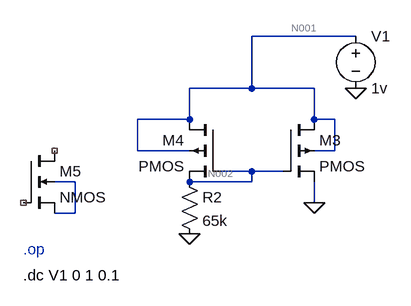
[diagram p0: schematic Draft3.asc]
Draft3.asc, the LTspice schematic file:
Version 4
SHEET 1 880 688
WIRE 368 304 208 304
WIRE 208 384 208 304
WIRE 208 384 112 384
WIRE 304 384 208 384
WIRE 112 432 112 384
WIRE 112 432 32 432
WIRE 304 432 304 384
WIRE 336 432 304 432
WIRE 32 480 32 432
WIRE 112 480 32 480
WIRE 336 480 336 432
WIRE 336 480 304 480
WIRE 208 512 160 512
WIRE 256 512 208 512
WIRE -64 528 -96 528
WIRE 208 528 208 512
WIRE 208 528 112 528
WIRE 304 560 304 528
WIRE -64 576 -64 528
WIRE -64 576 -96 576
FLAG 112 608 0
FLAG 304 560 0
FLAG 368 384 0
SYMBOL pmos4 256 432 R0
SYMATTR InstName M3
SYMBOL pmos4 160 432 M0
SYMATTR InstName M4
SYMBOL res 96 512 R0
SYMATTR InstName R2
SYMATTR Value 65k
SYMBOL voltage 368 288 R0
WINDOW 123 0 0 Left 0
WINDOW 39 0 0 Left 0
SYMATTR InstName V1
SYMATTR Value 1v
SYMBOL nmos4 -144 480 R0
SYMATTR InstName M5
TEXT -144 632 Left 2 ;.op
TEXT -144 672 Left 2 !.dc V1 0 1 0.1

The netlist it stands for:
* Draft3.asc
M3 N001 N002 0 N001 PMOS
M4 N001 N002 N002 N001 PMOS
R2 N002 0 65k
V1 N001 0 1v
M5 NC_01 NC_02 N003 N003 NMOS
.model NMOS NMOS
.model PMOS PMOS
.lib standard.mos
* .op
.dc V1 0 1 0.1
.backanno
.end

* Results of the author's LTspice run, read from the files saved beside the schematic
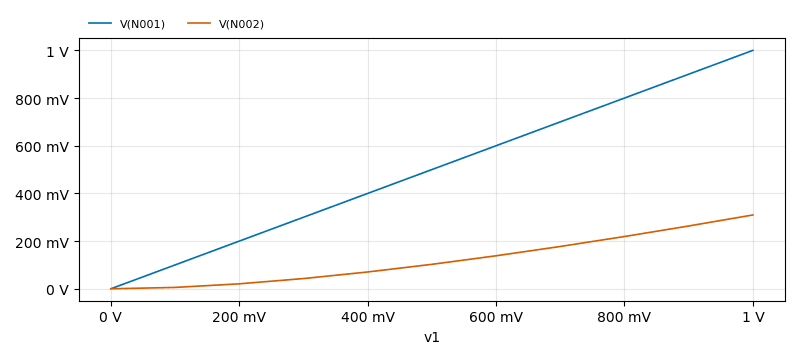
[diagram p1: DC transfer characteristic of Draft3.asc, plotted from the saved traces]
* DC transfer characteristic, 1 run:
*   V(N001): 0 V at v1=0 V, 1 V at v1=1 V, min 0 V, max 1 V
*   V(N002): 0 V at v1=0 V, 309.7 mV at v1=1 V, min 0 V, max 309.7 mV